# Altium schematic sheet LED_Buttons.SchDoc
size A4; CompanyName: Technische Hochschule Nürnberg Georg Simon Ohm; Organization: UltraZohm; Address1: Kesslerplatz 12; Address2: 90489 Nürnberg; Address3: GERMANY; DocumentNumber: 4; SheetNumber: 3; SheetTotal: 6; Website: www.ultrazohm.com
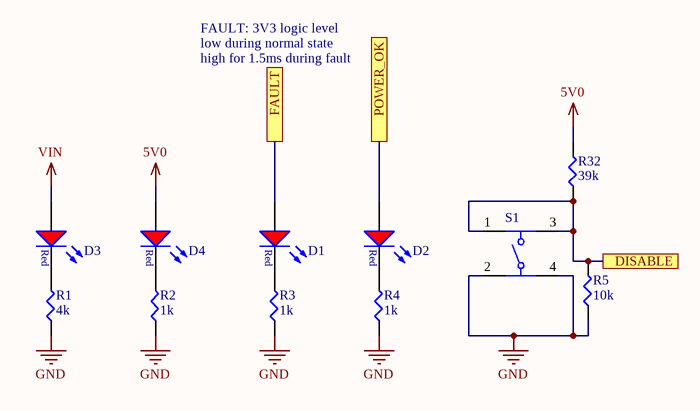
[diagram p0: LED_Buttons.SchDoc]

## Parts
D1  150060RS75000  [WL-SMCW_0603]  (value not drawn)
D2  150060RS75000  [WL-SMCW_0603]  (value not drawn)
D3  150060RS75000  [WL-SMCW_0603]  (value not drawn)
D4  150060RS75000  [WL-SMCW_0603]  (value not drawn)
R1  4k  [RESC0603]
R2  1k  [RESC0603]
R3  1k  [RESC0603]
R4  1k  [RESC0603]
R5  10k  [RESC0603]
R32  39k  [RESC0603]
S1  434153017835  [434153017835]  (value not drawn)

## Ports
DISABLE, FAULT, POWER_OK

## Nets
5V0: D4.2(A) R32.2
GND: R1.1 R2.1 R3.1 R4.1 R5.1 S1.2 S1.4
VIN: D3.2(A)
DISABLE: R5.2 R32.1 S1.1 S1.3 ; port DISABLE
FAULT: D1.2(A) ; port FAULT
POWER_OK: D2.2(A) ; port POWER_OK
NetD1_1: D1.1(K) R3.2
NetD2_1: D2.1(K) R4.2
NetD3_1: D3.1(K) R1.2
NetD4_1: D4.1(K) R2.2

## Notes on the sheet
- FAULT: 3V3 logic level
- low during normal state
- high for 1.5ms during fault
- Title
- Revision:
- Design Engineer:
- Date:
- Project:
- Sheet
- of

## Library data of the parts
D1-D4 = LED_Red_0603: WL-SMCW SMD Mono-color Chip LED Waterclear, size 0603, Red, 2 V, 140°; Forward Voltage: 2 V; Luminous Intensity: 250 mcd; Peak Wavelength: 630 nm; Dominant Wavelength: 625 nm; MF: Wuerth Elektronik; Published Date: Sep. 2017; ComponentLink1Description: Manufacturer; ComponentLink1URL: http://www.we-online.de; ComponentLink2Description: Datasheet; ComponentLink2URL: http://katalog.we-online.com/led/datasheet/150060RS75000.pdf; MPN: 150060RS75000; Size: 0603; Viewing Angle: 140°; Emitting Color: Red; Value: 150060RS75000; Package: 0603; Created: 2018_09_06_AGeiger; Supplier 1: Farnell; Supplier Part Number 1: 2322071; Supplier 2: Mouser; Supplier Part Number 2: 710-150060RS75000; Supplier 3: Digi-Key; Supplier Part Number 3: 732-4978-1-ND
R1-R5 R32 = RES_SMD: RES SMD; Part Number: Generic 1% tol.; Publisher: Generic
  R1: VALUE: 4k
  R2-R4: VALUE: 1k
  R5: VALUE: 10k
  R32: VALUE: 39k
S1 = 434153017835: WS-TASV J-Bend SMT Tact Switch 3.5x2.9mm, height 1.7mm, 350gf; Rated Voltage: 12VDC; Rated Current: 50mA; Washable: No; ComponentLink1Description: Manufacturer; ComponentLink1URL: http://www.we-online.de; ComponentLink2Description: Datasheet; ComponentLink2URL: https://katalog.we-online.com/em/datasheet/434153017835.pdf; Operating Temperature: -40 to +85degC; Part Number: 434153017835; Published Date: September 2019; Contact Material: Stainless Steel; Height: 1.7mm; Mounting Technology: SMT; Contact Plating: Silver; Operation Force: 350gf; Packaging: Tape and Reel; Terminal Material: Copper Alloy; Publisher: Wurth Elektronik; Terminal Plating: Silver